# Altium project Submersion Module.PrjPCB
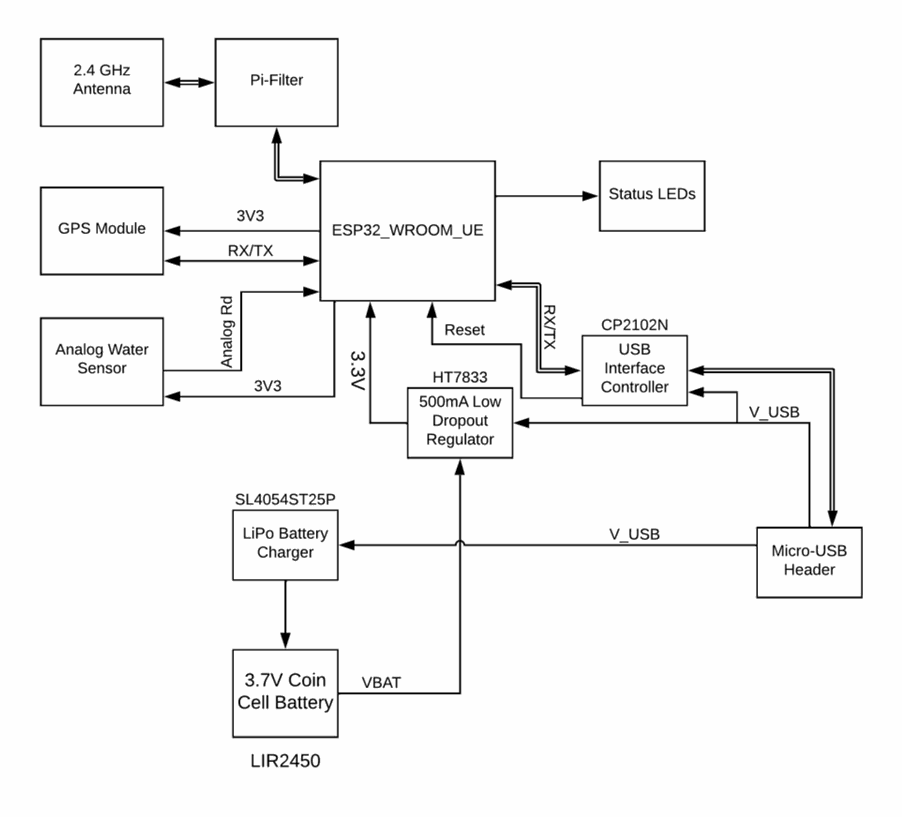
[diagram p0: SM0_Overview.SchDoc]
2 sheets, 43 parts. Net scope: global (net labels, ports and power ports of the same name join across sheets).
Board file: SM1_System..PcbDoc
Sheets:
  SM0_Overview.SchDoc
  SM1_System.SchDoc

## Sheet SM0_Overview.SchDoc
size A

## Sheet SM1_System.SchDoc: Submersion Module
size Letter; DrawnBy: x; Engineer: x; Address1: Dmitri Lyalikov; Address2: Dlyalikov01@Manhattan.edu; Address3: Dlyalikov01@Manhattan.edu; DocumentNumber: 1; Revision: 4; SheetNumber: 1; SheetTotal: 1; ImagePath: x
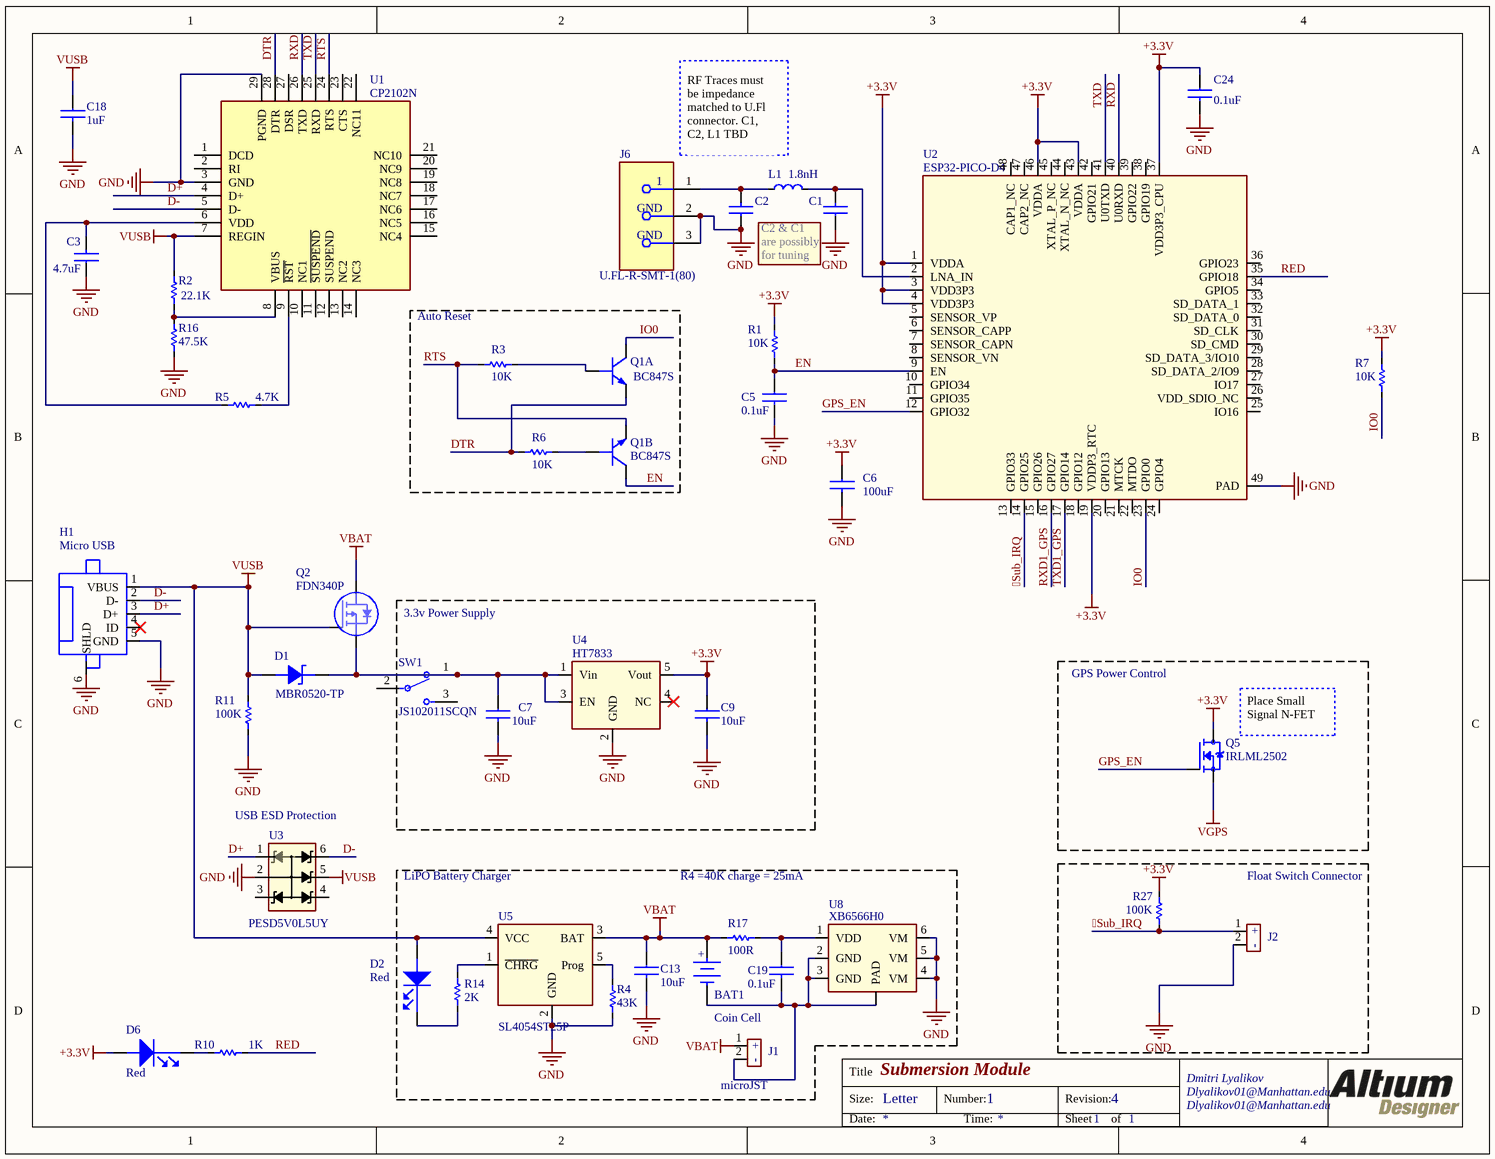
[diagram p1: SM1_System.SchDoc]

### Parts
BAT1  BATTERY-HOLDER (2450)  [BU2450SM-JJ-GTR]  (value not drawn)
C1  (no value)  [CAPC1005X56N]  (no BOM)
C2  (no value)  [CAPC1005X56N]  (no BOM)
C3  4.7uF  [CAPC1005X56N]
C5  0.1uF  [CAPC1005X56N]
C6  100uF  [CAPC3216X160L]
C7  10uF  [CAPC2012X140N]
C9  10uF  [CAPC2012X140N]
C13  10uF  [CAPC2012X140N]
C18  1uF  [CAPC1005X56N]
C19  0.1uF  [CAPC1005X56N]
C24  0.1uF  [CAPC1005X56N]
D1  MBR0520-TP  [SOD123]
D2  value Red  [LED1608X55N-RED]  (hidden comment: LED_0603)
D6  value Red  [LED1608X55N-RED]  (hidden comment: LED_0603)
H1  Micro USB  [1981584-1]
J1  CON2  [JST_Micro_2PIN]  (value not drawn)  (no BOM)
J2  CON2  [JST_Micro_2PIN]  (value not drawn)  (no BOM)
J6  U.FL-R-SMT-1(80)  [FP-U_FL-R-SMT-1_80-MFG]
L1  value 1.8nH  [RESC1005X40L]  (hidden comment: Inductor)
Q1  BC847S  [SOT65P210X110-6N]  (parts A,B of 2)
Q2  FDN340P  [SOT95P240X110-3N]
Q5  IRLML2502  [SOT95P237X112-3N]
R1  10K  [RESC1005X40L]
R2  22.1K  [RESC1005X40L]
R3  10K  [RESC1005X40L]
R4  43K  [RESC1005X40L]
R5  4.7K  [RESC1005X40L]
R6  10K  [RESC1005X40L]
R7  10K  [RESC1005X40L]
R10  1K  [RESC1005X40L]
R11  100K  [RESC1005X40L]
R14  2K  [RESC1005X40L]
R16  47.5K  [RESC1005X40L]
R17  100R  [RESC1005X40L]
R27  100K  [RESC1005X40L]
SW1  JS102011SCQN  [FP-JS102011SCQN-MFG]
U1  CP2102N  [28-QFN]
U2  ESP32-PICO-D4  [QFN48]
U3  PESD5V0L5UY  [SOT65P210X110-6N]
U4  HT7833  [SOT95P280X144-5N]
U5  SL4054ST25P  [SOT95P280X144-5N]
U8  XB6566H0  [DFN-6 2x2mm]

### Blocks framed on the sheet
Auto Reset: Q1 R3 R6
3.3v Power Supply: C7 C9 SW1 U4
GPS Power Control: Q5
Float Switch Connector: J2 R27

### Nets
+3.3V: C6.1 C9.1 C24.1 D6.2(ANODE) Q5.3(D) R1.1 R7.1 R27.1 U2.1(VDDA) U2.3(VDD3P3) U2.4(VDD3P3) U2.19(VDDP3_RTC) U2.37(VDD3P3_CPU) U2.43(VDDA) U2.46(VDDA) U4.5(Vout)
GND: C1.1 C2.1 C3.1 C5.2 C6.2 C7.2 C9.2 C13.2 C18.2 C24.2 H1.5(GND) H1.6(SHLD) J2.2 J6.2(GND) J6.3(GND) R4.2 R11.2 R16.1 U1.3(GND) U1.29(PGND) U2.49(PAD) U3.2 U4.2(GND) U5.2(GND) U8.4(VM) U8.5(VM) U8.6(VM)
VBAT: BAT1.1(+) C13.1 J1.1 Q2.3(D) R17.1 U5.3(BAT)
VGPS: Q5.2(S)
VUSB: C18.1 D1.2(Annode) D2.2(ANODE) H1.1(VBUS) Q2.1(G) R2.2 R11.1 U1.7(REGIN) U3.5 U5.4(VCC)
Sub_IRQ: J2.1 R27.2 U2.14(GPIO25)
D+: H1.3(D+) U1.4(D+) U3.1
D-: H1.2(D-) U1.5(D-) U3.6
DTR: Q1.1(E1) R6.2 U1.28(DTR)
EN: C5.1 Q1.3(C2) R1.2 U2.9(EN)
GPS_EN: Q5.1(G) U2.12(GPIO32)
IO0: Q1.6(C1) R7.2 U2.23(GPIO0)
RED: R10.2 U2.35(GPIO18)
RTS: Q1.4(E2) R3.2 U1.24(RTS)
RXD: U1.26(TXD) U2.40(U0RXD)
RXD1_GPS: U2.16(GPIO27)
TXD: U1.25(RXD) U2.41(U0TXD)
TXD1_GPS: U2.17(GPIO14)
NetBAT1_2: BAT1.2(-) C19.2 J1.2 U8.2(GND) U8.3(GND) U8.7(PAD)
NetC1_2: C1.2 L1.2 U2.2(LNA_IN)
NetC2_2: C2.2 J6.1 L1.1
NetC3_2: C3.2 R5.1 U1.6(VDD)
NetC7_1: C7.1 D1.1(Cathode) Q2.2(S) SW1.1 U4.1(Vin) U4.3(EN)
NetC19_1: C19.1 R17.2 U8.1(VDD)
NetD2_1: D2.1(CATHODE) R14.1
NetD6_1: D6.1(CATHODE) R10.1
NetQ1_2: Q1.2(B1) R3.1
NetQ1_5: Q1.5(B2) R6.1
NetR2_1: R2.1 R16.2 U1.8(VBUS)
NetR4_1: R4.1 U5.5(Prog)
NetR5_2: R5.2 U1.9(~{RST})
NetR14_2: R14.2 U5.1(~{CHRG})

Not connected (* = marked no-connect by the designer): H1 4(ID)*; SW1 2(C) 3; U1 1(DCD) 2(RI) 10(NC1) 11(~{SUSPEND}) 12(SUSPEND) 13(NC2) 14(NC3) 15(NC4) 16(NC5) 17(NC6) 18(NC7) 19(NC8) 20(NC9) 21(NC10) 22(NC11) 23(CTS) 27(DSR); U2 5(SENSOR_VP) 6(SENSOR_CAPP) 7(SENSOR_CAPN) 8(SENSOR_VN) 10(GPIO34) 11(GPIO35) 13(GPIO33) 15(GPIO26) 18(GPIO12) 20(GPIO13) 21(MTCK) 22(MTDO) 24(GPIO4) 25(IO16) 26(VDD_SDIO_NC) 27(IO17) 28(SD_DATA_2/IO9) 29(SD_DATA_3/IO10) 30(SD_CMD) 31(SD_CLK) 32(SD_DATA_0) 33(SD_DATA_1) 34(GPIO5) 36(GPIO23) 38(GPIO19) 39(GPIO22) 42(GPIO21) 44(XTAL_N_NC) 45(XTAL_P_NC) 47(CAP2_NC) 48(CAP1_NC); U3 3 4; U4 4(NC)*

### Notes on the sheet
- RF Traces must be impedance matched to U.Fl connector. C1, C2, L1 TBD
- C2 & C1
- are possibly
- for tuning
- (near Q5) Place Small Signal N-FET
- (near U3) USB ESD Protection
- LiPO Battery Charger
- R4 =40K charge = 25mA
- Coin Cell
- (near J1) microJST
- Title
- Size:
- Letter
- Number:
- Revision:
- Date:
- Time:
- Sheet
- of
- (in symbol JST_Micro_CONN_2PIN) +; -

### Library data of the parts
BAT1 = BU2450SM-JJ-GTR: HOLDER,BATT,COIN,24.5MM,SMT; Manufacturer: MPD; Value: Coin Cell Holder; Vendor: LCSC; PartNumber: BU2450SM-JJ-GTR
C1 C2 = CAP_0402: DNP
C3 = CAP_0603: CAP CER 4.7uF 16V 0402; PartNumber: CM05X5R475M16AH; Manufacturer: Kyocera; Vendor: LCSC; Value: 4.7uF
C5 C19 C24 = CAP_0402: CAP CER 0.1uF 16V 0402; PartNumber: TCC0402X5R104M160AT; Manufacturer: CCTC; Vendor: LCSC; Value: 0.1uF
C6 = CAP_1206: CAP CER 100uF 6.3V 1206; PartNumber: JMK316BJ107ML-T; Manufacturer: Taiyo Yuden; Vendor: LCSC; Value: 100uF
C7 C9 = CAP_0805: CAP 10uF 0805; Manufacturer: Murata; PartNumber: GRM21BB31C106KE15L; Vendor: LCSC; Value: 10uF
C13 = CAP_0805: CAP CER 10uF 16V 0805; PartNumber: CL21A106KOQNNNG; Manufacturer: Samsung; Vendor: LCSC; Value: 10uF
C18 = CAP_0603: CAP CER 1uF 16V 0402; PartNumber: GRM155R61C105KA12D; Manufacturer: Murata; Vendor: LCSC; Value: 1uF
D1 = MBR0520-TP: DIODE SCHOTTKY 20V 500MA SOD123; Manufacturer: CJ; Vendor: LCSC; PartNumber: MBR0520; Value: MBR0520
D2 D6 = LED_0603: LED RED CLEAR 0603 SMD; Manufacturer: FNO; PartNumber: FC-DA1608HRK-620D; Vendor: LCSC
H1 = 1981584-1: CONN RCPT MICRO USB TYPE AB; Manufacturer: REG CON; PartNumber: C21377; Vendor: LCSC; Value: Micro USB
J1 J2 = JST_Micro_CONN_2PIN: JST MIcro CONN 2POS
J6 = CMP-11598-000004-1: CONN U.FL RCPT STR 50 OHM SMD; Mating Cycles: 30; Impedance: 50R; Body Plating: Silver; Center Contact Plating: Gold; Body Material: Bronze; Dielectric Material: Polymer; Connector Type: Receptacle; Number of Ports: 1; Max Frequency: 6GHz; Mount: Surface Mount; Termination: Solder; Case/Package: SMD/SMT; Min Operating Temperature: -40°C; Series: U.FL; Max Operating Temperature: 90°C; Fastening Type: SNAP-ON; RoHS Compliant: Yes; Packaging: Tape and Reel; Package Quantity: 10000; Contact Material: Brass; Housing Color: Beige; Lead Free: Lead Free
L1 = Inductor: Inductor 1.8nH 0402; PartNumber: BKW0603UC1N8KGT; Manufacturer: GFBE; Vendor: LCSC
Q1 = BC847S: TRANS 2NPN 44V 0.1A SC-70-6; Manufacturer: Changjiang; Vendor: LCSC; PartNumber: BC847S; Value: 2NPN
Q2 = FDN340P: MOSFET P-CH 20V 2A SOT-23; Manufacturer: On Semi; Vendor: LCSC; Value: Mosfet P-H; PartNumber: FDN340P
Q5 = IRLML2502: N-Channel 20 V 4.2A (Ta) 1.25W (Ta) Surface Mount Micro3Ã¢â€žÂ¢ /SOT-23; MF: Infineon Technologies; Check_prices: https://www.snapeda.com/parts/IRLML2502/Infineon+Technologies/view-part/?ref=eda; Value: *; SnapEDA_Link: https://www.snapeda.com/parts/IRLML2502/Infineon+Technologies/view-part/?ref=snap; Package: SOT-23-3 International Rectifier; Availability: Not in stock; Price: None; MP: IRLML2502
R1 R3 R6 R7 R27 = RES_0402: RES SMD 10K OHM 0402; PartNumber: RC-02W1002FT; Manufacturer: Guangdong; Vendor: LCSC
  R1 R3 R6 R7: Value: 10K
  R27: Value: 100K
R2 = RES_0603: RES SMD 22.1K OHM 0402; Manufacturer: Yageo; PartNumber: RC0402FR-0722K1L; Vendor: LCSC; Value: 22.1K
R4 = RES_0603: RES SMD 43K OHM 0402; Manufacturer: Uniroyal; PartNumber: 0402WGF4302TCE; Vendor: LCSC; Value: 43K
R5 = RES_0603: RES SMD 4.7K OHM 0402; Manufacturer: Yageo; PartNumber: RC0402FR-074K7L; Vendor: LCSC; Value: 4.7K
R10 = RES_0402: RES SMD 1K OHM 0402; PartNumber: RC0402FR-071KL; Manufacturer: Yageo; Vendor: LCSC; Value: 1K
R11 = RES_0603: RES SMD 100K OHM 0402; Manufacturer: Uniroyal Elec; PartNumber: 0402WGF1003TCE; Vendor: LCSC; Value: 100K
R14 = RES_0603: RES SMD 2K OHM 1% 1/10W 0402; Manufacturer: LIZ Elec; PartNumber: CR0402FF2001G; Vendor: LCSC; Value: 2K
R16 = RES_0603: RES SMD 47.5K OHM 0402; Manufacturer: Yageo; PartNumber: RC0402FR-0747K5L; Vendor: LCSC; Value: 47.5K
R17 = RES_0603: RES SMD 100R OHM 1% 1/10W 0402; Manufacturer: Yageo; PartNumber: RC0402FR-07100RL; Vendor: LCSC; Value: 100R
SW1 = CMP-10038-000023-1: SWITCH SLIDE SPDT 300MA 6V; Electrical Life: 5000Cycles; Actuator Type: Standard; Contact Resistance: 70mR; Actuator Material: Nylon; Max Voltage Rating (DC): 30V; Actuator Length: 2mm; Switch Function: On-On; Actuator Color: Black; Radiation Hardening: No; Throw Configuration: SPDT; Depth: 7.5mm; Case/Package: SMD/SMT; Package Quantity: 4000; Min Operating Temperature: -40°C; Length: 8.5mm; Current Rating: 300mA; Mount: Surface Mount; Voltage Rating (DC): 6V; RoHS Compliant: Yes; Orientation: Straight; Housing Material: Nylon; Contact Plating: Silver; Max Operating Temperature: 85°C; Packaging: Tape and Reel; Switch Travel: 2mm; Max Current Rating: 300mA; Contact Material: Copper Alloy; Series: JS; Termination: Gull Wing
U1 = CP2102N: IC BRIDGE USB TO UART 28QFN; Manufacturer: Silicon Labs; PartNumber: CP2102N-A01-GQFN28; Vendor: LCSC; Value: CP2102N
U2 = ESP32-PICO-D4: RF Transceiver ICs QFN-48_7x7x05P RoHS; Manufacturer: Espressif; Vendor: LCSC; Value: ESP32-PICO-D4; PartNumber: ESP32-PICO-D4
U3 = PESD5V0L5UY: TVS SOT-363 RoHS; Manufacturer: Yenji; Vendor: LCSC; Value: ESD; PartNumber: PESD5V0L5UY
U4 = HT7833: IC LDO 3.3V 0.5A SOT23-5; Manufacturer: Holtek; Vendor: LCSC; PartNumber: HT7833; Value: LDO 3.3V
U5 = SL4054ST25P: Charger IC Lithium-Ion/Polymer SOT23-5; Manufacturer: Techfuse; Vendor: LCSC; PartNumber: SL4054ST25P; Value: SL4054ST25P
U8 = XB6566H0: IC Battery Protection; Manufacturer: XySemi; Vendor: LCSC; PartNumber: XB6566H0; Value: Battery Protection